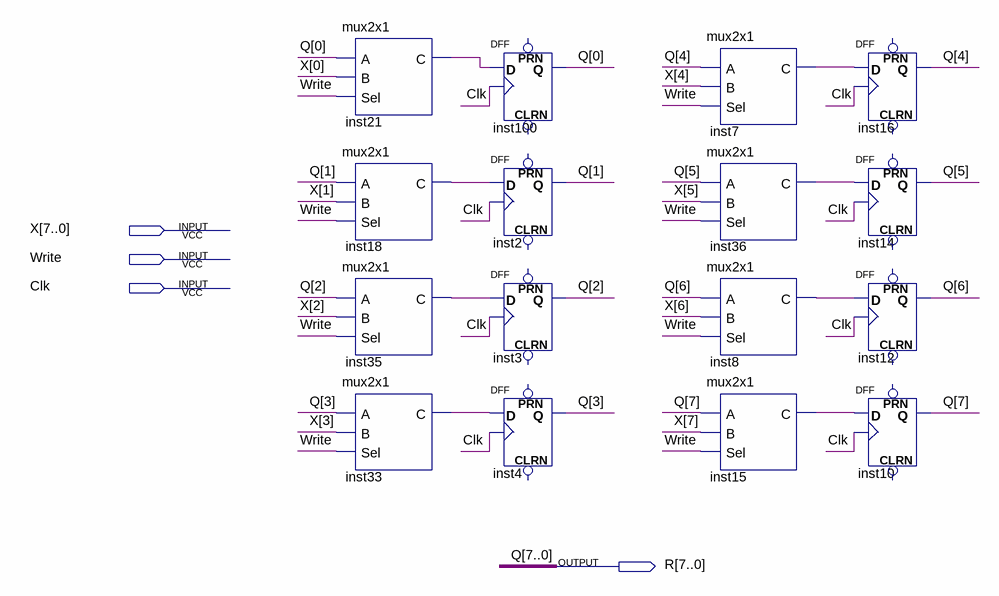
[diagram p0: schematic sheet]
// Quartus schematic regByte.bdf as structural Verilog: 16 symbols, 4 pins
module regByte (
  input  [7:0] X,
  input  Write,
  input  Clk,
  output [7:0] R
);

  wire inst7_c, inst8_c, inst15_c, inst18_c, inst21_c, inst33_c, inst35_c, inst36_c;

  mux2x1 inst21 (.A(R[0]), .B(X[0]), .Sel(Write), .C(inst21_c));
  mux2x1 inst18 (.A(R[1]), .B(X[1]), .Sel(Write), .C(inst18_c));
  mux2x1 inst35 (.A(R[2]), .B(X[2]), .Sel(Write), .C(inst35_c));
  mux2x1 inst33 (.A(R[3]), .B(X[3]), .Sel(Write), .C(inst33_c));
  DFF inst100 (.CLK(Clk), .D(inst21_c), .Q(R[0]));  // open: CLRN, PRN
  DFF inst2 (.CLK(Clk), .D(inst18_c), .Q(R[1]));  // open: CLRN, PRN
  DFF inst3 (.CLK(Clk), .D(inst35_c), .Q(R[2]));  // open: CLRN, PRN
  DFF inst4 (.CLK(Clk), .D(inst33_c), .Q(R[3]));  // open: CLRN, PRN
  mux2x1 inst7 (.A(R[4]), .B(X[4]), .Sel(Write), .C(inst7_c));
  mux2x1 inst36 (.A(R[5]), .B(X[5]), .Sel(Write), .C(inst36_c));
  mux2x1 inst8 (.A(R[6]), .B(X[6]), .Sel(Write), .C(inst8_c));
  mux2x1 inst15 (.A(R[7]), .B(X[7]), .Sel(Write), .C(inst15_c));
  DFF inst16 (.CLK(Clk), .D(inst7_c), .Q(R[4]));  // open: CLRN, PRN
  DFF inst14 (.CLK(Clk), .D(inst36_c), .Q(R[5]));  // open: CLRN, PRN
  DFF inst12 (.CLK(Clk), .D(inst8_c), .Q(R[6]));  // open: CLRN, PRN
  DFF inst10 (.CLK(Clk), .D(inst15_c), .Q(R[7]));  // open: CLRN, PRN

  // Other names for the same wires on the sheet: Q[7:0] = R
endmodule
